# Altium schematic sheet RS485.SchDoc
size A; SheetNumber: 2; SheetTotal: 8
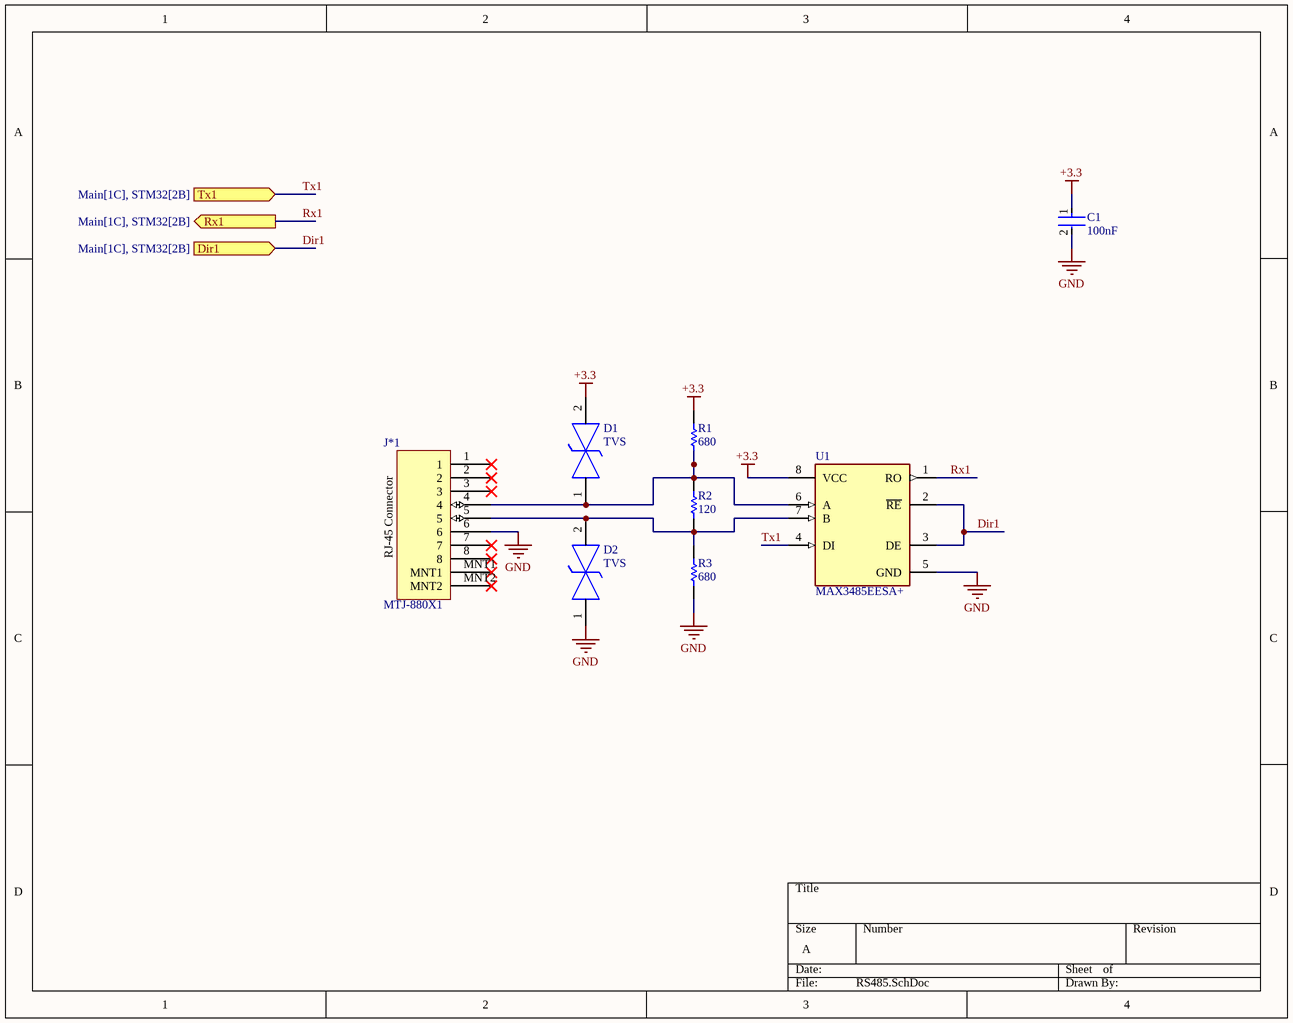
[diagram p0: RS485.SchDoc]

## Parts
C1  100nF  [FP-0805-L_2_01_0_2-W_1_25-IPC_B]
D1  TVS  [FP-SMB-MFG]
D2  TVS  [FP-SMB-MFG]
J*1  MTJ-880X1  [MTJ-880X1]
R1  680  [RESC2013X50X30LL20T20]
R2  120  [RESC2013X50X30LL20T20]
R3  680  [RESC2013X50X30LL20T20]
U1  MAX3485EESA+  [FP-S8-5-MFG]

## Ports
Dir1 (in, see Main[1C], STM32[2B]), Rx1 (out, see Main[1C], STM32[2B]), Tx1 (in, see Main[1C], STM32[2B])

## Nets
+3.3: C1.1 D1.2 R1.2 U1.8(VCC)
GND: C1.2 D2.1 J*1.6 R3.1 U1.5(GND)
Dir1: U1.2(~{RE}) U1.3(DE) ; port Dir1
Rx1: U1.1(RO) ; port Rx1
Tx1: U1.4(DI) ; port Tx1
NetD1_1: D1.1 J*1.4 R1.1 R2.2 U1.6(A)
NetD2_2: D2.2 J*1.5 R2.1 R3.2 U1.7(B)

Not connected (* = marked no-connect by the designer): J*1 1* 2* 3* 7* 8* MNT1* MNT2*

## Notes on the sheet
- (in symbol MTJ-880X1) RJ-45 Connector

## Library data of the parts
C1 = CMP-2007-04174-2: General Purpose Ceramic Capacitor, 0805, 100nF, 10%, X7R, 15%, 100V; Packaging: Tape and Reel; Min Operating Temperature: -55°C; Dielectric Material: Ceramic; Height: 1.4mm; Voltage Rating: 100V; Termination: SMD/SMT; Case Code (Imperial): 0805; Case Code (Metric): 2012; Case/Package: 0805; Construction: Flat; Radiation Hardening: No; Series: -; Dielectric: X7R; Package Quantity: 2000; Mount: Surface Mount; Capacitance: 100nF; Contact Plating: Tin; Voltage: 100V; Lead Free: Lead Free; Depth: 1.25mm; RoHS Compliant: Yes; Number of Pins: 2; Max Operating Temperature: 125°C; Length: 2.01mm; Voltage Rating (DC): 100V; Thickness: 0.055inch; REACH SVHC: No SVHC; Width: 0.049inch; Tolerance: 10%
D1 D2 = CMP-12225-000039-1: TVS DIODE 28.2V 59V SMB; Manufacturer Part Number: SM6T33CA; Manufacturer: STMicroelectronics; Max Junction Temp: +150°C; Standoff Height: 0.05mm; Direction: Bidirectional; Number Of Channels: 1; Reverse Standoff Voltage: 33V; Peak Pulse Current: 68A; Breakdown Voltage: 31.4V; Peak Pulse Power: 600W; Mouser Description: TVS Diodes - Transient Voltage Suppressors 600W 33V Bidirect; Device Class L1: Circuit Protection; Device Class L3: unset; Temperature Range Low: -55°C; Octopart: https://octopart.com/sm6t33ca-stmicroelectronics-55399331; Height: 2.65mm; Digikey Description: TVS DIODE 28.2V 59V SMB; Automotive: No; Category: Diode; Device Class L2: TVS Diodes; Temperature: -55°C to +150°C; ComponentLink2URL: https://www.st.com/resource/en/datasheet/sm6t.pdf; Lead Free: Yes; Clamping Voltage: 59V; RoHS: TRUE; Temperature Range High: +150°C; Package: SMB; ComponentLink2Description: Datasheet
R1-R3 = CMP-2001-04896-1: Manufacturer: Vishay Dale; Part Number: CRCW08050000Z0EA
U1 = CMP-05679-000038-1: IC TXRX RS485/422 10MBPS 8SOIC; Manufacturer: Maxim Integrated; Number Of Receivers: 1; Simplex Duplex: Half Duplex; Data Rate: 15Mbits/s; Interface: RS-485,RS-422; Max Supply Voltage: 3.6V; Nominal Supply Current: 0.95-1.1mA; Min Supply Voltage: 3V; Standoff Height: 0.1mm; Mouser Description: RS-422/RS-485 Interface IC 3.3V 12Mbps Transceiver; Lead Free: Yes; Footprint Url: https://pdfserv.maximintegrated.com/land_patterns/90-0096.PDF; Device Class L1: Integrated Circuits (ICs); Device Class L3: RS-232 / RS-422 / RS-485 Interface ICs; RoHS: TRUE; Height: 1.75mm; ComponentLink2URL: https://datasheets.maximintegrated.com/en/ds/MAX3483E-MAX3491E.pdf; Temperature Range High: +85°C; Temperature: -40°C to +85°C; Manufacturer Part Number: MAX3485EESA+; Number Of Transmitters: 1; Device Class L2: Interface ICs; Octopart: https://octopart.com/max3485eesa%2B-maxim+integrated-39731903; ComponentLink2Description: Datasheet; Category: IC; Digikey Description: IC TXRX RS485/422 10MBPS 8SOIC; Automotive: No; Temperature Range Low: -40°C; Package: S8-5